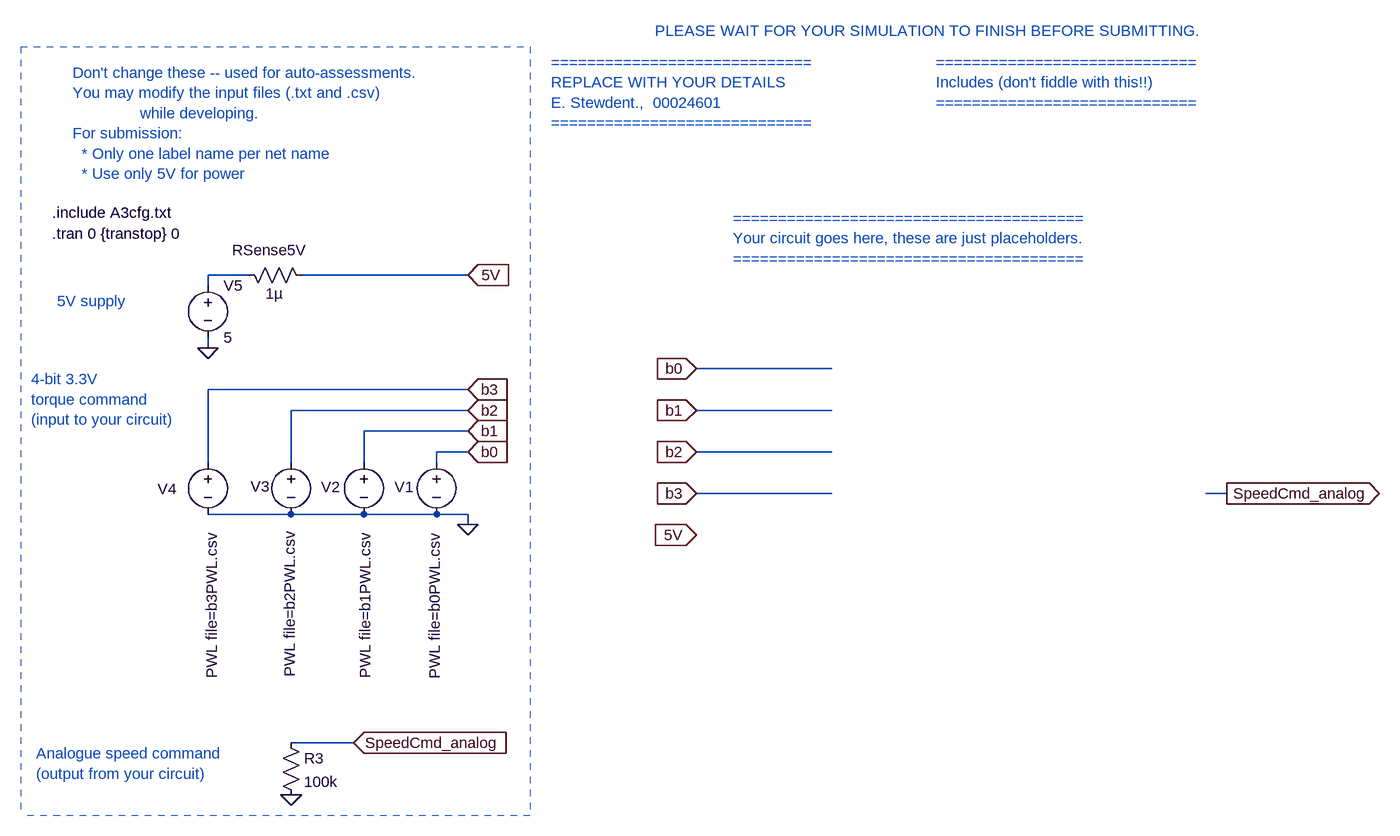
[diagram p0: schematic E344_Ass3_DAC.asc]
E344_Ass3_DAC.asc, the LTspice schematic file:
Version 4
SHEET 1 1824 2192
WIRE -2016 -1072 -2080 -1072
WIRE -1680 -1072 -1936 -1072
WIRE -2080 -1056 -2080 -1072
WIRE -2080 -960 -2080 -976
WIRE -1120 -928 -1328 -928
WIRE -1680 -896 -2080 -896
WIRE -1680 -864 -1952 -864
WIRE -1120 -864 -1328 -864
WIRE -1680 -832 -1840 -832
WIRE -1680 -800 -1728 -800
WIRE -1120 -800 -1328 -800
WIRE -2080 -784 -2080 -896
WIRE -1952 -784 -1952 -864
WIRE -1840 -784 -1840 -832
WIRE -1728 -784 -1728 -800
WIRE -1120 -736 -1328 -736
WIRE -512 -736 -544 -736
WIRE -1952 -704 -2080 -704
WIRE -1840 -704 -1952 -704
WIRE -1728 -704 -1840 -704
WIRE -1680 -704 -1728 -704
WIRE -1680 -688 -1680 -704
WIRE -1856 -352 -1952 -352
FLAG -1680 -1072 5V
IOPIN -1680 -1072 In
FLAG -2080 -960 0
FLAG -1328 -672 5V
IOPIN -1328 -672 In
FLAG -512 -736 SpeedCmd_analog
IOPIN -512 -736 Out
FLAG -1680 -688 0
FLAG -1680 -896 b3
IOPIN -1680 -896 In
FLAG -1680 -864 b2
IOPIN -1680 -864 In
FLAG -1680 -832 b1
IOPIN -1680 -832 In
FLAG -1680 -800 b0
IOPIN -1680 -800 In
FLAG -1328 -736 b3
IOPIN -1328 -736 In
FLAG -1328 -800 b2
IOPIN -1328 -800 In
FLAG -1328 -864 b1
IOPIN -1328 -864 In
FLAG -1328 -928 b0
IOPIN -1328 -928 In
FLAG -1856 -352 SpeedCmd_analog
IOPIN -1856 -352 In
FLAG -1952 -272 0
SYMBOL voltage -2080 -1072 R0
WINDOW 123 0 0 Left 0
WINDOW 39 0 0 Left 0
SYMATTR InstName V5
SYMATTR Value 5
SYMBOL res -2032 -1088 M90
WINDOW 0 -7 47 VBottom 2
WINDOW 3 29 54 VTop 2
SYMATTR InstName RSense5V
SYMATTR Value 1µ
SYMBOL voltage -1728 -800 R0
WINDOW 3 -3 125 VRight 2
WINDOW 123 0 0 Left 0
WINDOW 39 0 0 Left 0
WINDOW 0 -65 54 Left 2
SYMATTR Value PWL file=b0PWL.csv
SYMATTR InstName V1
SYMBOL voltage -1840 -800 R0
WINDOW 3 2 124 VRight 2
WINDOW 123 0 0 Left 0
WINDOW 39 0 0 Left 0
WINDOW 0 -66 54 Left 2
SYMATTR Value PWL file=b1PWL.csv
SYMATTR InstName V2
SYMBOL voltage -1952 -800 R0
WINDOW 3 -2 122 VRight 2
WINDOW 123 0 0 Left 0
WINDOW 39 0 0 Left 0
WINDOW 0 -62 53 Left 2
SYMATTR Value PWL file=b2PWL.csv
SYMATTR InstName V3
SYMBOL voltage -2080 -800 R0
WINDOW 3 6 124 VRight 2
WINDOW 123 0 0 Left 0
WINDOW 39 0 0 Left 0
WINDOW 0 -77 57 Left 2
SYMATTR Value PWL file=b3PWL.csv
SYMATTR InstName V4
SYMBOL res -1968 -368 R0
SYMATTR InstName R3
SYMATTR Value 100k
TEXT -2288 -1384 Left 2 ;Don't change these -- used for auto-assessments.\nYou may modify the input files (.txt and .csv) \n               while developing.\nFor submission: \n  * Only one label name per net name\n  * Use only 5V for power
TEXT -1552 -1400 Left 2 ;=============================\nREPLACE WITH YOUR DETAILS\nE. Stewdent.,  00024601\n=============================
TEXT -960 -1400 Left 2 ;=============================\nIncludes (don't fiddle with this!!)\n=============================
TEXT -1272 -1160 Left 2 ;=======================================\nYour circuit goes here, these are just placeholders.\n=======================================
TEXT -1392 -1448 Left 2 ;PLEASE WAIT FOR YOUR SIMULATION TO FINISH BEFORE SUBMITTING.
TEXT -2320 -1136 Left 2 !.tran 0 {transtop} 0
TEXT -2320 -1168 Left 2 !.include A3cfg.txt
TEXT -2312 -1032 Left 2 ;5V supply
TEXT -2352 -912 Left 2 ;4-bit 3.3V\ntorque command\n(input to your circuit)
TEXT -2344 -336 Left 2 ;Analogue speed command\n(output from your circuit)
LINE Normal -1584 -1424 -1584 -240 2
LINE Normal -2368 -1424 -1584 -1424 2
LINE Normal -1584 -240 -2368 -240 2
LINE Normal -1584 -256 -1584 -256 2
LINE Normal -2368 -1424 -2368 -240 2

The netlist it stands for:
* E344_Ass3_DAC.asc
V5 N001 0 5
RSense5V N001 5V 1µ
V1 b0 0 PWL file=b0PWL.csv
V2 b1 0 PWL file=b1PWL.csv
V3 b2 0 PWL file=b2PWL.csv
V4 b3 0 PWL file=b3PWL.csv
R3 SpeedCmd_analog 0 100k
* Don't change these -- used for auto-assessments.
* You may modify the input files (.txt and .csv)
*                while developing.
* For submission:
*   * Only one label name per net name
*   * Use only 5V for power
* =============================
* REPLACE WITH YOUR DETAILS
* E. Stewdent.,  00024601
* =============================
* =============================
* Includes (don't fiddle with this!!)
* =============================
* =======================================
* Your circuit goes here, these are just placeholders.
* =======================================
* PLEASE WAIT FOR YOUR SIMULATION TO FINISH BEFORE SUBMITTING.
.tran 0 {transtop} 0
.include A3cfg.txt
* 5V supply
* 4-bit 3.3V
* torque command
* (input to your circuit)
* Analogue speed command
* (output from your circuit)
.backanno
.end